# Altium schematic sheet Nixie.SchDoc
size A
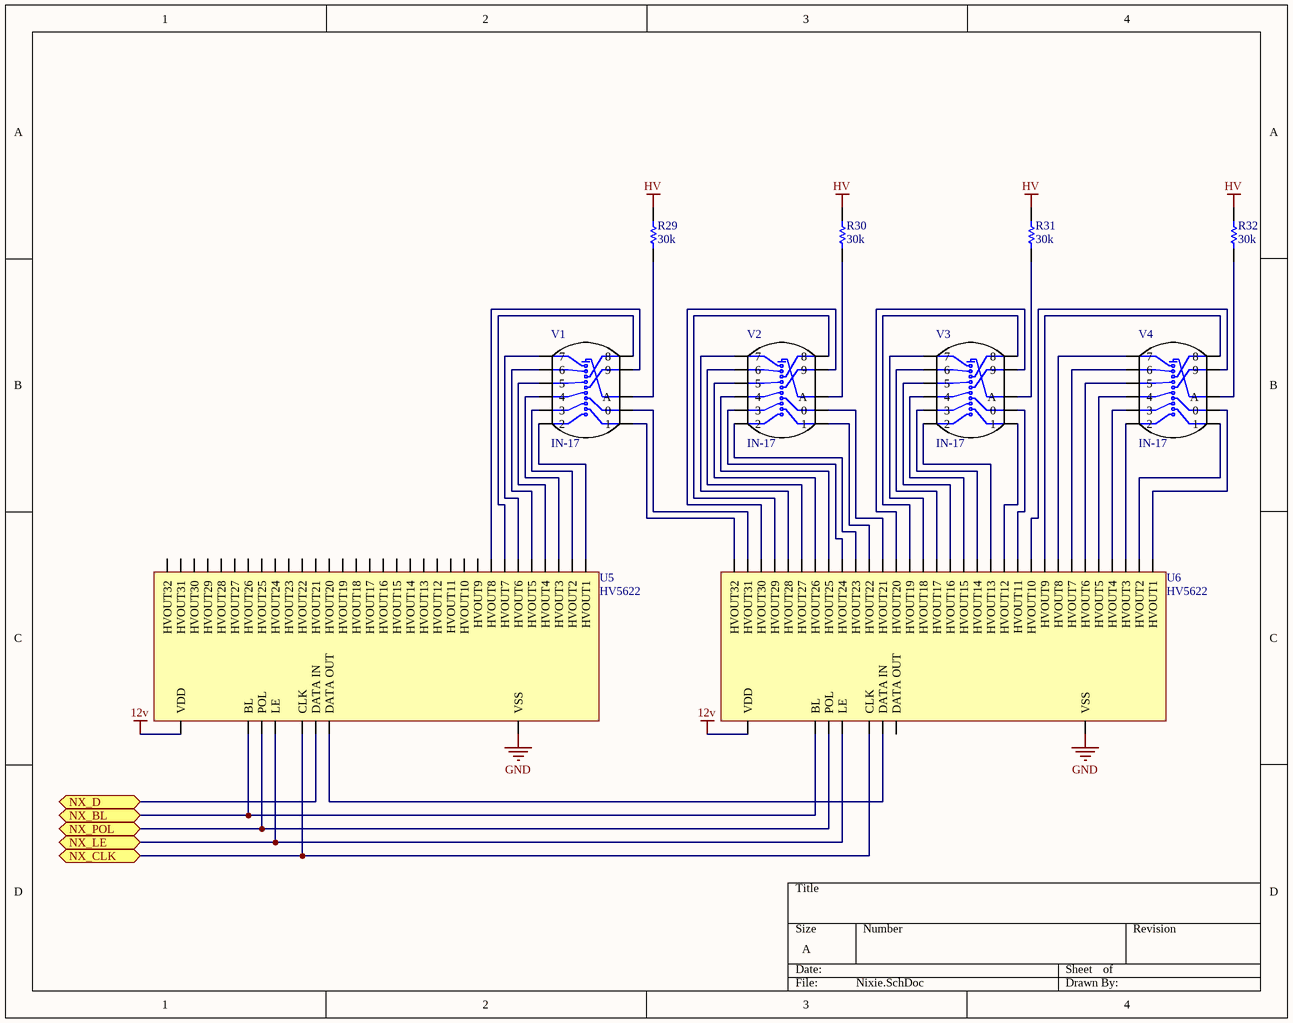
[diagram p0: Nixie.SchDoc]

## Parts
R29  30k  [R0805]
R30  30k  [R0805]
R31  30k  [R0805]
R32  30k  [R0805]
U5  HV5622  [44-PQFP]
U6  HV5622  [44-PQFP]
V1  IN-17  [IN-17]
V2  IN-17  [IN-17]
V3  IN-17  [IN-17]
V4  IN-17  [IN-17]

## Ports
NX_BL, NX_CLK, NX_D, NX_LE, NX_POL

## Nets
12v: U5.30(VDD) U6.30(VDD)
GND: U5.29(VSS) U6.29(VSS)
HV: R29.2 R30.2 R31.2 R32.2
NX_BL: U5.33(BL) U6.33(BL) ; port NX_BL
NX_CLK: U5.28(CLK) U6.28(CLK) ; port NX_CLK
NX_D: U5.32(DATA_IN) ; port NX_D
NX_LE: U5.31(LE) U6.31(LE) ; port NX_LE
NX_POL: U5.27(POL) U6.27(POL) ; port NX_POL
NetR29_1: R29.1 V1.1(A)
NetR30_1: R30.1 V2.1(A)
NetR31_1: R31.1 V3.1(A)
NetR32_1: R32.1 V4.1(A)
NetU5_15: U5.15(HVOUT8) V1.11(9)
NetU5_16: U5.16(HVOUT7) V1.10(8)
NetU5_17: U5.17(HVOUT6) V1.9(7)
NetU5_18: U5.18(HVOUT5) V1.8(6)
NetU5_19: U5.19(HVOUT4) V1.7(5)
NetU5_20: U5.20(HVOUT3) V1.6(4)
NetU5_21: U5.21(HVOUT2) V1.5(3)
NetU5_22: U5.22(HVOUT1) V1.4(2)
NetU5_23: U5.23(DATA_OUT) U6.32(DATA_IN)
NetU6_1: U6.1(HVOUT22) V2.3(1)
NetU6_2: U6.2(HVOUT21) V2.2(0)
NetU6_3: U6.3(HVOUT20) V3.11(9)
NetU6_4: U6.4(HVOUT19) V3.10(8)
NetU6_5: U6.5(HVOUT18) V3.9(7)
NetU6_6: U6.6(HVOUT17) V3.8(6)
NetU6_7: U6.7(HVOUT16) V3.7(5)
NetU6_8: U6.8(HVOUT15) V3.6(4)
NetU6_9: U6.9(HVOUT14) V3.5(3)
NetU6_10: U6.10(HVOUT13) V3.4(2)
NetU6_11: U6.11(HVOUT12) V3.3(1)
NetU6_12: U6.12(HVOUT11) V3.2(0)
NetU6_13: U6.13(HVOUT10) V4.11(9)
NetU6_14: U6.14(HVOUT9) V4.10(8)
NetU6_15: U6.15(HVOUT8) V4.9(7)
NetU6_16: U6.16(HVOUT7) V4.8(6)
NetU6_17: U6.17(HVOUT6) V4.7(5)
NetU6_18: U6.18(HVOUT5) V4.6(4)
NetU6_19: U6.19(HVOUT4) V4.5(3)
NetU6_20: U6.20(HVOUT3) V4.4(2)
NetU6_21: U6.21(HVOUT2) V4.3(1)
NetU6_22: U6.22(HVOUT1) V4.2(0)
NetU6_35: U6.35(HVOUT32) V1.3(1)
NetU6_36: U6.36(HVOUT31) V1.2(0)
NetU6_37: U6.37(HVOUT30) V2.11(9)
NetU6_38: U6.38(HVOUT29) V2.10(8)
NetU6_39: U6.39(HVOUT28) V2.9(7)
NetU6_40: U6.40(HVOUT27) V2.8(6)
NetU6_41: U6.41(HVOUT26) V2.7(5)
NetU6_42: U6.42(HVOUT25) V2.6(4)
NetU6_43: U6.43(HVOUT24) V2.5(3)
NetU6_44: U6.44(HVOUT23) V2.4(2)

Not connected (* = marked no-connect by the designer): U5 1(HVOUT22) 2(HVOUT21) 3(HVOUT20) 4(HVOUT19) 5(HVOUT18) 6(HVOUT17) 7(HVOUT16) 8(HVOUT15) 9(HVOUT14) 10(HVOUT13) 11(HVOUT12) 12(HVOUT11) 13(HVOUT10) 14(HVOUT9) 35(HVOUT32) 36(HVOUT31) 37(HVOUT30) 38(HVOUT29) 39(HVOUT28) 40(HVOUT27) 41(HVOUT26) 42(HVOUT25) 43(HVOUT24) 44(HVOUT23); U6 23(DATA_OUT)

## Library data of the parts
R29-R32 = 30k 0805 5%: RES SMD 30K OHM 5% 1/8W 0805; Supplier 1: Digi-Key; Supplier Part Number 1: RMCF0805JT30K0CT-ND
U5 U6 = HV5622: IC 32BIT SRL PARALLEL 220V 44PQF; Supplier 1: Digi-Key; Supplier Part Number 1: HV5622PG-G-ND
V1-V4 = IN-17 Nixie: IN-17 Nixie Display Tube